# Altium schematic sheet RK3588_MIPI.SchDoc
size 594 x 420 mm; SheetNumber: 8; SheetTotal: 23
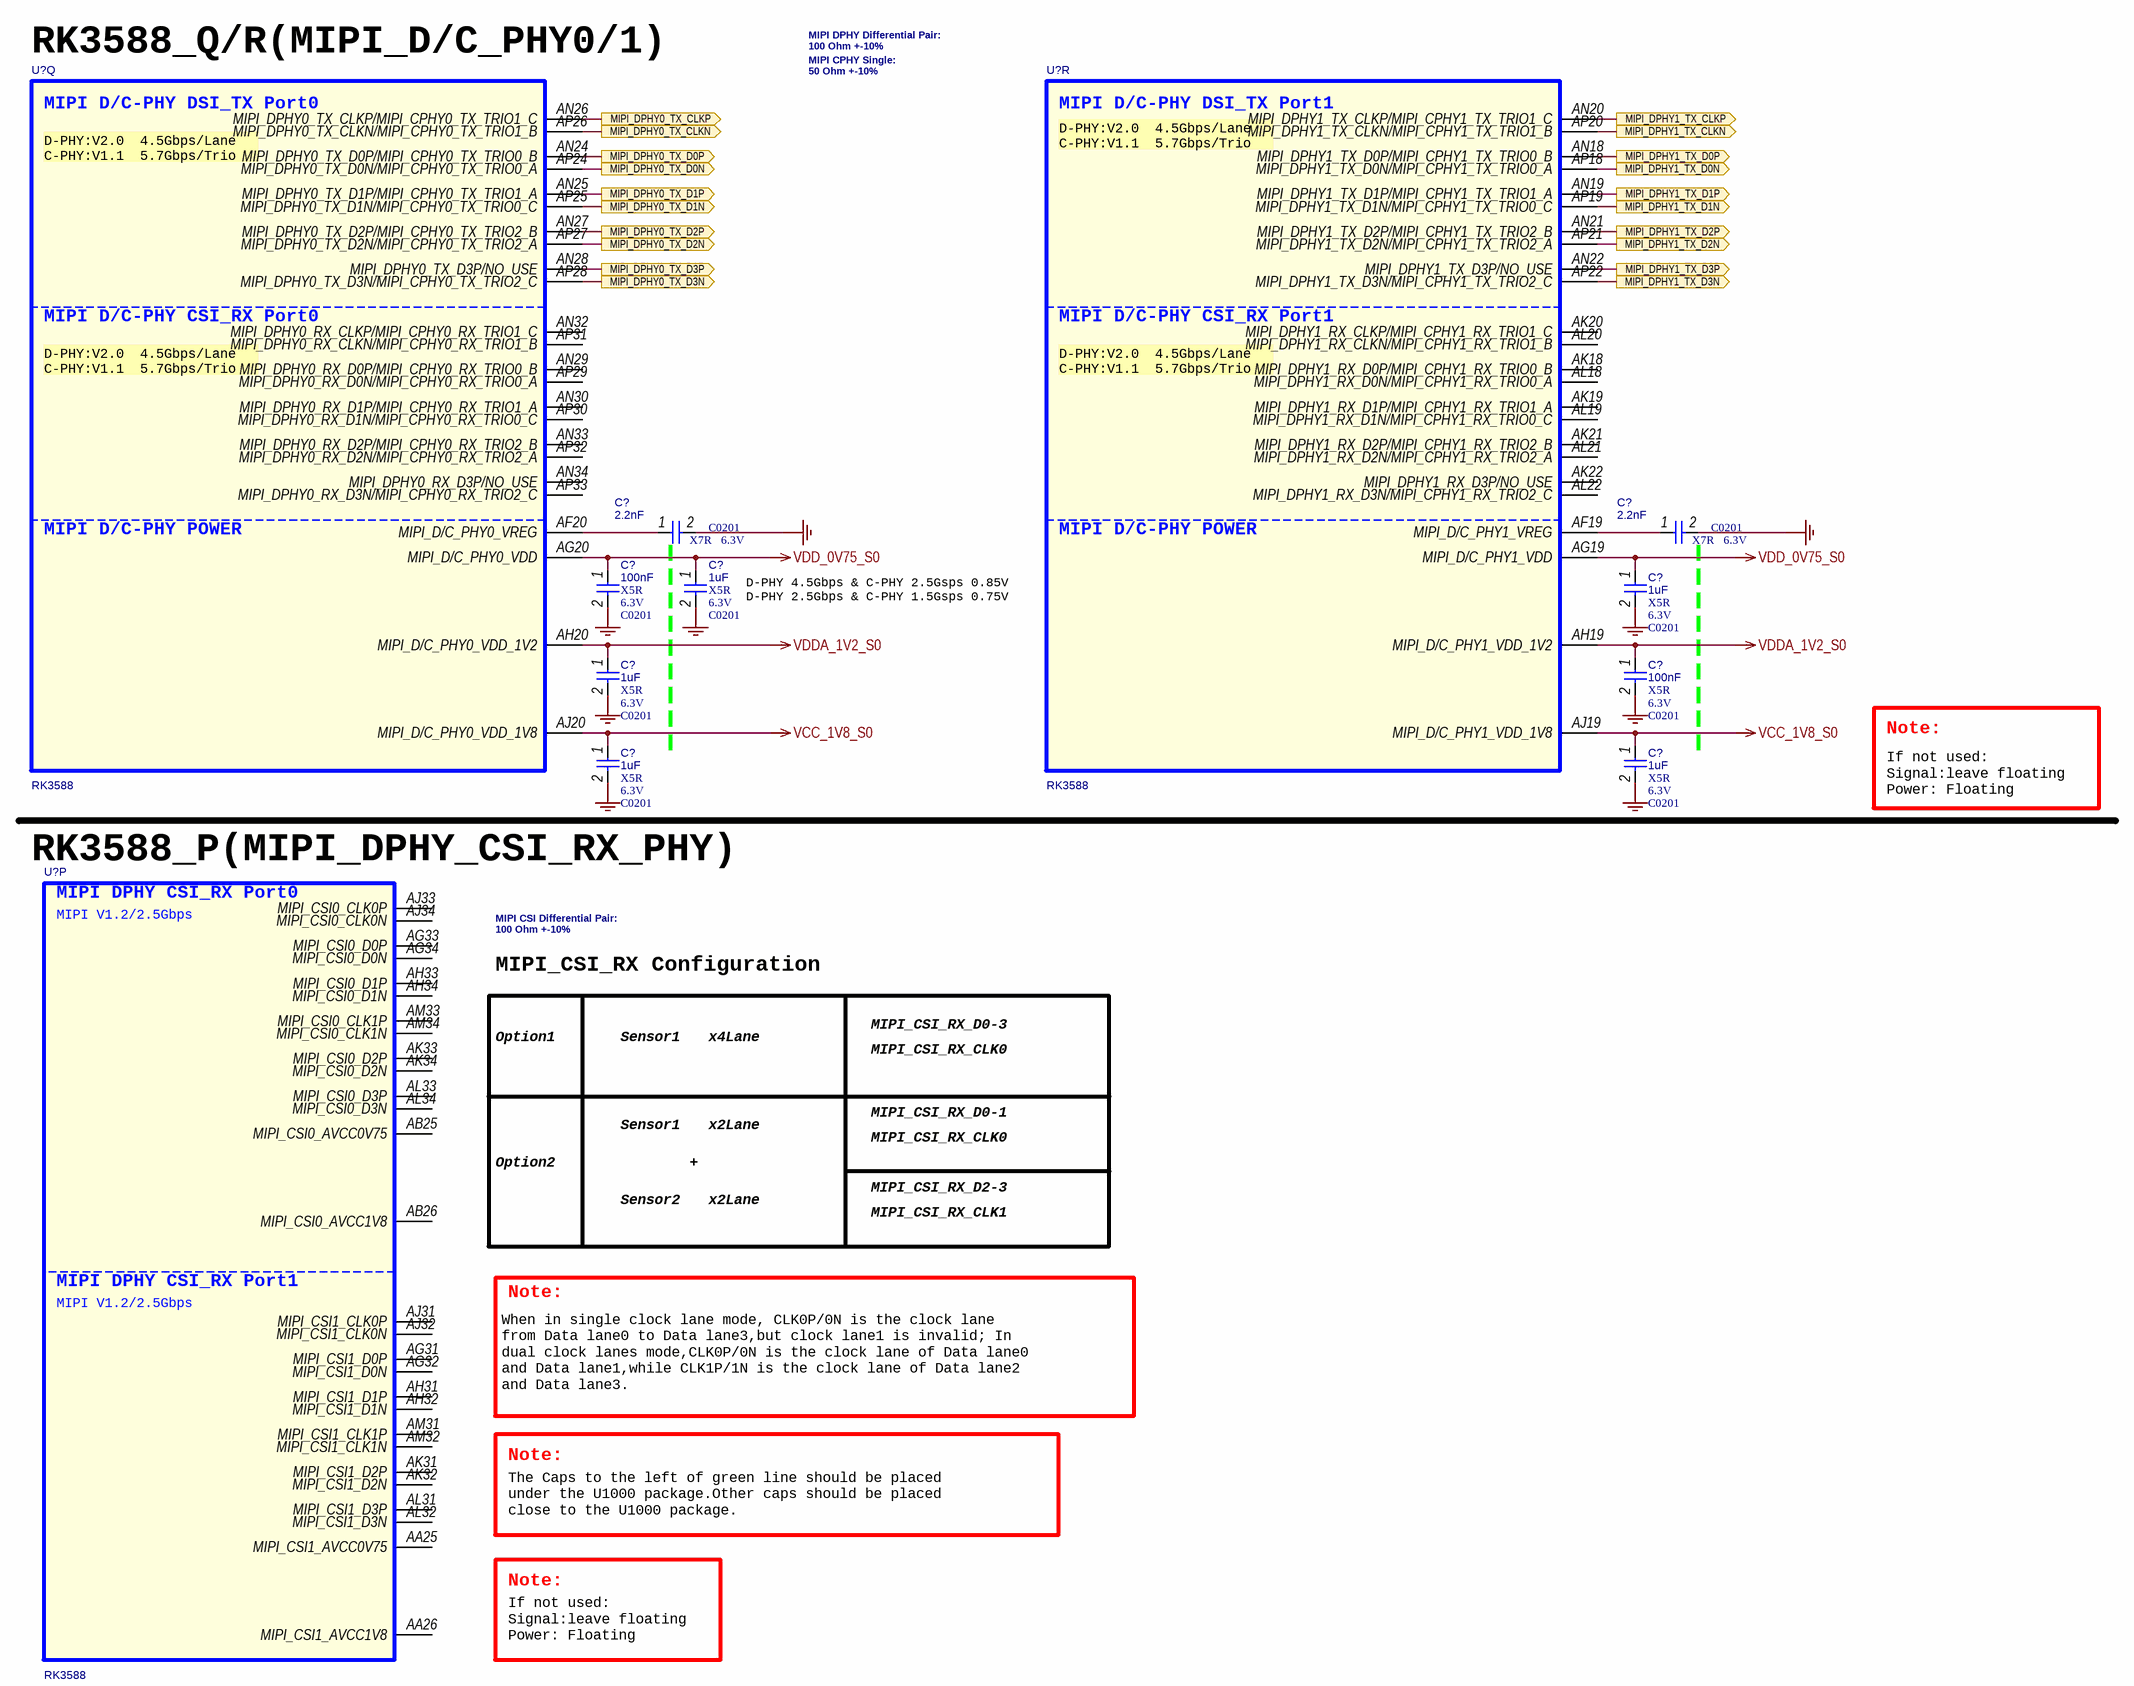
[diagram p0: RK3588_MIPI.SchDoc]

## Parts
(Parts that share a designator on the sheet are numbered #1, #2 ... from top to bottom, then left to right.)
C?#1  2.2nF  Dielectric: X7R  Voltage: 6.3V  [C0201]
C?#2  2.2nF  Dielectric: X7R  Voltage: 6.3V  [C0201]
C?#3  100nF  Dielectric: X5R  Voltage: 6.3V  [C0201]
C?#4  1uF  Dielectric: X5R  Voltage: 6.3V  [C0201]
C?#5  1uF  Dielectric: X5R  Voltage: 6.3V  [C0201]
C?#6  1uF  Dielectric: X5R  Voltage: 6.3V  [C0201]
C?#7  100nF  Dielectric: X5R  Voltage: 6.3V  [C0201]
C?#8  1uF  Dielectric: X5R  Voltage: 6.3V  [C0201]
C?#9  1uF  Dielectric: X5R  Voltage: 6.3V  [C0201]
U?#1  RK3588  [BGA1088_23R00X23R00X2R00]  (part Q of 26)
U?#2  RK3588  [BGA1088_23R00X23R00X2R00]  (part R of 26)
U?#3  RK3588  [BGA1088_23R00X23R00X2R00]  (part P of 26)

## Ports
MIPI_DPHY0_TX_CLKN (out, see MIPI_D_CPHY_TX_DUAL[2A]), MIPI_DPHY0_TX_CLKP (out, see MIPI_D_CPHY_TX_DUAL[2A]), MIPI_DPHY0_TX_D0N (out, see MIPI_D_CPHY_TX_DUAL[2A]), MIPI_DPHY0_TX_D0P (out, see MIPI_D_CPHY_TX_DUAL[2A]), MIPI_DPHY0_TX_D1N (out, see MIPI_D_CPHY_TX_DUAL[2B]), MIPI_DPHY0_TX_D1P (out, see MIPI_D_CPHY_TX_DUAL[2A]), MIPI_DPHY0_TX_D2N (out, see MIPI_D_CPHY_TX_DUAL[2B]), MIPI_DPHY0_TX_D2P (out, see MIPI_D_CPHY_TX_DUAL[2B]), MIPI_DPHY0_TX_D3N (out, see MIPI_D_CPHY_TX_DUAL[2B]), MIPI_DPHY0_TX_D3P (out, see MIPI_D_CPHY_TX_DUAL[2B]), MIPI_DPHY1_TX_CLKN (out, see MIPI_D_CPHY_TX_DUAL[2B]), MIPI_DPHY1_TX_CLKP (out, see MIPI_D_CPHY_TX_DUAL[2B]), MIPI_DPHY1_TX_D0N (out, see MIPI_D_CPHY_TX_DUAL[2B]), MIPI_DPHY1_TX_D0P (out, see MIPI_D_CPHY_TX_DUAL[2B]), MIPI_DPHY1_TX_D1N (out, see MIPI_D_CPHY_TX_DUAL[2B]), MIPI_DPHY1_TX_D1P (out, see MIPI_D_CPHY_TX_DUAL[2B]), MIPI_DPHY1_TX_D2N (out, see MIPI_D_CPHY_TX_DUAL[2B]), MIPI_DPHY1_TX_D2P (out, see MIPI_D_CPHY_TX_DUAL[2B]), MIPI_DPHY1_TX_D3N (out, see MIPI_D_CPHY_TX_DUAL[2B]), MIPI_DPHY1_TX_D3P (out, see MIPI_D_CPHY_TX_DUAL[2B])

## Nets
GND: C?#1.2 C?#2.2 C?#3.2 C?#4.2 C?#5.2 C?#6.2 C?#7.2 C?#8.2 C?#9.2
VCC_1V8_S0: C?#8.1 C?#9.1 U?#1.AJ20(MIPI_D/C_PHY0_VDD_1V8) U?#2.AJ19(MIPI_D/C_PHY1_VDD_1V8)
VDD_0V75_S0: C?#3.1 C?#4.1 C?#5.1 U?#1.AG20(MIPI_D/C_PHY0_VDD) U?#2.AG19(MIPI_D/C_PHY1_VDD)
VDDA_1V2_S0: C?#6.1 C?#7.1 U?#1.AH20(MIPI_D/C_PHY0_VDD_1V2) U?#2.AH19(MIPI_D/C_PHY1_VDD_1V2)
MIPI_DPHY0_TX_CLKN: U?#1.AP26(MIPI_DPHY0_TX_CLKN/MIPI_CPHY0_TX_TRIO1_B) ; port MIPI_DPHY0_TX_CLKN
MIPI_DPHY0_TX_CLKP: U?#1.AN26(MIPI_DPHY0_TX_CLKP/MIPI_CPHY0_TX_TRIO1_C) ; port MIPI_DPHY0_TX_CLKP
MIPI_DPHY0_TX_D0N: U?#1.AP24(MIPI_DPHY0_TX_D0N/MIPI_CPHY0_TX_TRIO0_A) ; port MIPI_DPHY0_TX_D0N
MIPI_DPHY0_TX_D0P: U?#1.AN24(MIPI_DPHY0_TX_D0P/MIPI_CPHY0_TX_TRIO0_B) ; port MIPI_DPHY0_TX_D0P
MIPI_DPHY0_TX_D1N: U?#1.AP25(MIPI_DPHY0_TX_D1N/MIPI_CPHY0_TX_TRIO0_C) ; port MIPI_DPHY0_TX_D1N
MIPI_DPHY0_TX_D1P: U?#1.AN25(MIPI_DPHY0_TX_D1P/MIPI_CPHY0_TX_TRIO1_A) ; port MIPI_DPHY0_TX_D1P
MIPI_DPHY0_TX_D2N: U?#1.AP27(MIPI_DPHY0_TX_D2N/MIPI_CPHY0_TX_TRIO2_A) ; port MIPI_DPHY0_TX_D2N
MIPI_DPHY0_TX_D2P: U?#1.AN27(MIPI_DPHY0_TX_D2P/MIPI_CPHY0_TX_TRIO2_B) ; port MIPI_DPHY0_TX_D2P
MIPI_DPHY0_TX_D3N: U?#1.AP28(MIPI_DPHY0_TX_D3N/MIPI_CPHY0_TX_TRIO2_C) ; port MIPI_DPHY0_TX_D3N
MIPI_DPHY0_TX_D3P: U?#1.AN28(MIPI_DPHY0_TX_D3P/NO_USE) ; port MIPI_DPHY0_TX_D3P
MIPI_DPHY1_TX_CLKN: U?#2.AP20(MIPI_DPHY1_TX_CLKN/MIPI_CPHY1_TX_TRIO1_B) ; port MIPI_DPHY1_TX_CLKN
MIPI_DPHY1_TX_CLKP: U?#2.AN20(MIPI_DPHY1_TX_CLKP/MIPI_CPHY1_TX_TRIO1_C) ; port MIPI_DPHY1_TX_CLKP
MIPI_DPHY1_TX_D0N: U?#2.AP18(MIPI_DPHY1_TX_D0N/MIPI_CPHY1_TX_TRIO0_A) ; port MIPI_DPHY1_TX_D0N
MIPI_DPHY1_TX_D0P: U?#2.AN18(MIPI_DPHY1_TX_D0P/MIPI_CPHY1_TX_TRIO0_B) ; port MIPI_DPHY1_TX_D0P
MIPI_DPHY1_TX_D1N: U?#2.AP19(MIPI_DPHY1_TX_D1N/MIPI_CPHY1_TX_TRIO0_C) ; port MIPI_DPHY1_TX_D1N
MIPI_DPHY1_TX_D1P: U?#2.AN19(MIPI_DPHY1_TX_D1P/MIPI_CPHY1_TX_TRIO1_A) ; port MIPI_DPHY1_TX_D1P
MIPI_DPHY1_TX_D2N: U?#2.AP21(MIPI_DPHY1_TX_D2N/MIPI_CPHY1_TX_TRIO2_A) ; port MIPI_DPHY1_TX_D2N
MIPI_DPHY1_TX_D2P: U?#2.AN21(MIPI_DPHY1_TX_D2P/MIPI_CPHY1_TX_TRIO2_B) ; port MIPI_DPHY1_TX_D2P
MIPI_DPHY1_TX_D3N: U?#2.AP22(MIPI_DPHY1_TX_D3N/MIPI_CPHY1_TX_TRIO2_C) ; port MIPI_DPHY1_TX_D3N
MIPI_DPHY1_TX_D3P: U?#2.AN22(MIPI_DPHY1_TX_D3P/NO_USE) ; port MIPI_DPHY1_TX_D3P
NetC?#1_1: C?#1.1 U?#1.AF20(MIPI_D/C_PHY0_VREG)
NetC?#2_1: C?#2.1 U?#2.AF19(MIPI_D/C_PHY1_VREG)

Not connected (* = marked no-connect by the designer): U?#1 AN29(MIPI_DPHY0_RX_D0P/MIPI_CPHY0_RX_TRIO0_B) AN30(MIPI_DPHY0_RX_D1P/MIPI_CPHY0_RX_TRIO1_A) AN32(MIPI_DPHY0_RX_CLKP/MIPI_CPHY0_RX_TRIO1_C) AN33(MIPI_DPHY0_RX_D2P/MIPI_CPHY0_RX_TRIO2_B) AN34(MIPI_DPHY0_RX_D3P/NO_USE) AP29(MIPI_DPHY0_RX_D0N/MIPI_CPHY0_RX_TRIO0_A) AP30(MIPI_DPHY0_RX_D1N/MIPI_CPHY0_RX_TRIO0_C) AP31(MIPI_DPHY0_RX_CLKN/MIPI_CPHY0_RX_TRIO1_B) AP32(MIPI_DPHY0_RX_D2N/MIPI_CPHY0_RX_TRIO2_A) AP33(MIPI_DPHY0_RX_D3N/MIPI_CPHY0_RX_TRIO2_C); U?#2 AK18(MIPI_DPHY1_RX_D0P/MIPI_CPHY1_RX_TRIO0_B) AK19(MIPI_DPHY1_RX_D1P/MIPI_CPHY1_RX_TRIO1_A) AK20(MIPI_DPHY1_RX_CLKP/MIPI_CPHY1_RX_TRIO1_C) AK21(MIPI_DPHY1_RX_D2P/MIPI_CPHY1_RX_TRIO2_B) AK22(MIPI_DPHY1_RX_D3P/NO_USE) AL18(MIPI_DPHY1_RX_D0N/MIPI_CPHY1_RX_TRIO0_A) AL19(MIPI_DPHY1_RX_D1N/MIPI_CPHY1_RX_TRIO0_C) AL20(MIPI_DPHY1_RX_CLKN/MIPI_CPHY1_RX_TRIO1_B) AL21(MIPI_DPHY1_RX_D2N/MIPI_CPHY1_RX_TRIO2_A) AL22(MIPI_DPHY1_RX_D3N/MIPI_CPHY1_RX_TRIO2_C); U?#3 AA25(MIPI_CSI1_AVCC0V75) AA26(MIPI_CSI1_AVCC1V8) AB25(MIPI_CSI0_AVCC0V75) AB26(MIPI_CSI0_AVCC1V8) AG31(MIPI_CSI1_D0P) AG32(MIPI_CSI1_D0N) AG33(MIPI_CSI0_D0P) AG34(MIPI_CSI0_D0N) AH31(MIPI_CSI1_D1P) AH32(MIPI_CSI1_D1N) AH33(MIPI_CSI0_D1P) AH34(MIPI_CSI0_D1N) AJ31(MIPI_CSI1_CLK0P) AJ32(MIPI_CSI1_CLK0N) AJ33(MIPI_CSI0_CLK0P) AJ34(MIPI_CSI0_CLK0N) AK31(MIPI_CSI1_D2P) AK32(MIPI_CSI1_D2N) AK33(MIPI_CSI0_D2P) AK34(MIPI_CSI0_D2N) AL31(MIPI_CSI1_D3P) AL32(MIPI_CSI1_D3N) AL33(MIPI_CSI0_D3P) AL34(MIPI_CSI0_D3N) AM31(MIPI_CSI1_CLK1P) AM32(MIPI_CSI1_CLK1N) AM33(MIPI_CSI0_CLK1P) AM34(MIPI_CSI0_CLK1N)

## Notes on the sheet
- RK3588_Q/R(MIPI_D/C_PHY0/1)
- MIPI CPHY Single:
  50 Ohm +-10%
- MIPI DPHY Differential Pair:
  100 Ohm +-10%
- D-PHY 4.5Gbps & C-PHY 2.5Gsps 0.85V
  D-PHY 2.5Gbps & C-PHY 1.5Gsps 0.75V
- If not used:
  Signal:leave floating
  Power: Floating
- Note:
- RK3588_P(MIPI_DPHY_CSI_RX_PHY)
- MIPI_CSI_RX Configuration
- MIPI CSI Differential Pair:
  100 Ohm +-10%
- Option1
- Sensor1
- x4Lane
- MIPI_CSI_RX_D0-3
- MIPI_CSI_RX_CLK0
- Option2
- +
- x2Lane
- MIPI_CSI_RX_D0-1
- Sensor2
- MIPI_CSI_RX_D2-3
- MIPI_CSI_RX_CLK1
- When in single clock lane mode, CLK0P/0N is the clock lane
  from Data lane0 to Data lane3,but clock lane1 is invalid; In
  dual clock lanes mode,CLK0P/0N is the clock lane of Data lane0
  and Data lane1,while CLK1P/1N is the clock lane of Data lane2
  and Data lane3.
- The Caps to the left of green line should be placed
  under the U1000 package.Other caps should be placed
  close to the U1000 package.
- 420x594
- Формат А2
- (in symbol SOC_RK3588, part P) MIPI DPHY CSI_RX Port0; MIPI V1.2/2.5Gbps; MIPI DPHY CSI_RX Port1
- (in symbol SOC_RK3588, part Q) MIPI D/C-PHY DSI_TX Port0; D-PHY:V2.0  4.5Gbps/Lane / C-PHY:V1.1  5.7Gbps/Trio; MIPI D/C-PHY CSI_RX Port0; MIPI D/C-PHY POWER
- (in symbol SOC_RK3588, part R) MIPI D/C-PHY DSI_TX Port1; D-PHY:V2.0  4.5Gbps/Lane / C-PHY:V1.1  5.7Gbps/Trio; MIPI D/C-PHY CSI_RX Port1; MIPI D/C-PHY POWER

## Library data of the parts
C?#1 = CAP NP_Dup1: cap,2.20nF,+/-10%,6.3V,X7R,C0201; Part Reference: C1600; Manufacturer PN: C0603X7R0J222K030BA; Manufacturer: TDK; Tolerance: 10%; Priority: A; PCB Footprint: C0201; Value: 2.2nF; Created by: JJJ; Part Type: C0201; RK PN: C0603X7R0J222K030BA
C?#2 = CAP NP_Dup1: cap,2.20nF,+/-10%,6.3V,X7R,C0201; Part Reference: C1608; Manufacturer PN: C0603X7R0J222K030BA; Manufacturer: TDK; Tolerance: 10%; Priority: A; PCB Footprint: C0201; Value: 2.2nF; Created by: JJJ; Part Type: C0201; RK PN: C0603X7R0J222K030BA
C?#3 = CAP NP_Dup1: cap,100.00nF,+/-10%,6.3V,X5R,C0201; Part Reference: C1602; Manufacturer: TDK; RK PN: C0603X5R0J104K030BC; Priority: A; Tolerance: 10%; PCB Footprint: C0201; Value: 100nF; Part Type: C0201; Manufacturer PN: C0603X5R0J104K030BC; Created by: JJJ
C?#4 = CAP NP_Dup1: cap,1.00uF,+/-20%,6.3V,X5R,C0201; Part Reference: C1601; Manufacturer: TDK; RK PN: C0603X5R0J105M030BC; Priority: A; Tolerance: 20%; PCB Footprint: C0201; Value: 1uF; Part Type: C0201; Manufacturer PN: C0603X5R0J105M030BC; Created by: JJJ
C?#5 = CAP NP_Dup1: cap,1.00uF,+/-20%,6.3V,X5R,C0201; Part Reference: C1609; Manufacturer: TDK; RK PN: C0603X5R0J105M030BC; Priority: A; Tolerance: 20%; PCB Footprint: C0201; Value: 1uF; Part Type: C0201; Manufacturer PN: C0603X5R0J105M030BC; Created by: JJJ
C?#6 = CAP NP_Dup1: cap,1.00uF,+/-20%,6.3V,X5R,C0201; Part Reference: C1603; Manufacturer PN: C0603X5R0J105M030BC; Manufacturer: TDK; Tolerance: 20%; Priority: A; PCB Footprint: C0201; Value: 1uF; Created by: JJJ; Part Type: C0201; RK PN: C0603X5R0J105M030BC
C?#7 = CAP NP_Dup1: cap,100.00nF,+/-10%,6.3V,X5R,C0201; Part Reference: C1611; Manufacturer: TDK; RK PN: C0603X5R0J104K030BC; Priority: A; Tolerance: 10%; PCB Footprint: C0201; Value: 100nF; Part Type: C0201; Manufacturer PN: C0603X5R0J104K030BC; Created by: JJJ
C?#8 = CAP NP_Dup1: cap,1.00uF,+/-20%,6.3V,X5R,C0201; Part Reference: C1605; Manufacturer PN: C0603X5R0J105M030BC; Manufacturer: TDK; Tolerance: 20%; Priority: A; PCB Footprint: C0201; Value: 1uF; Created by: JJJ; Part Type: C0201; RK PN: C0603X5R0J105M030BC
C?#9 = CAP NP_Dup1: cap,1.00uF,+/-20%,6.3V,X5R,C0201; Part Reference: C1613; Manufacturer: TDK; RK PN: C0603X5R0J105M030BC; Priority: A; Tolerance: 20%; PCB Footprint: C0201; Value: 1uF; Part Type: C0201; Manufacturer PN: C0603X5R0J105M030BC; Created by: JJJ
U?#1-U?#3 = SOC_RK3588: ROCKCHIP SOC; Part Reference: U1000; Manufacturer: Rockchip (ИрРѕОў); SWAP_INFO: (S1+S2+S3+S4+S5+S6+S7+S8+S9+S10+S11+S12+S13+S14+S15+S16+S17+S18+S19+S20+S21+S22+S23+S24+S25+S26); SPLIT_INST: TRUE; Priority: A; Value: RK3588; PCB Footprint: BGA1088_23R00X23R00X2R00; Created by: YWQ; Manufacturer PN: RK3588; Part Type: SOC; RK PN: RK3588